# EAGLE design 24V_LM7824 (EAGLE 9.5.1)
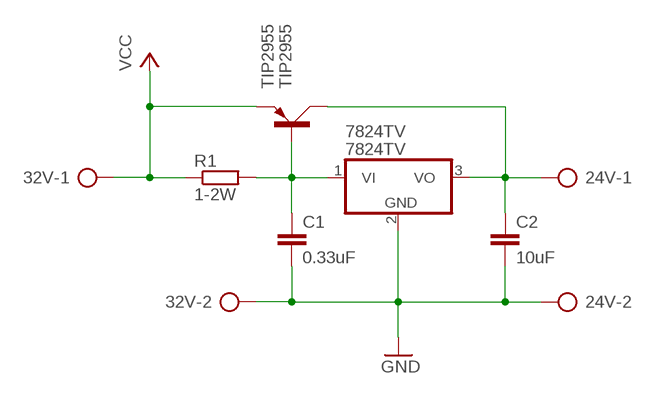
[diagram p0: schematic, sheet 1]

## Parts
24V  SMKDSP_1,5/2  [SMKDSP_1,5/2]
32V  SMKDSP_1,5/2  [SMKDSP_1,5/2]
7824TV  7824TV  [TO220V]
C1  0.33uF  C-EU025-025X050  [C025-025X050]
C2  10uF  C-EU025-025X050  [C025-025X050]
R1  1-2W  R-EU_0309/10  [0309/10]
TIP2955  TIP2955  [TOP3AV]

## Nets
GND: 24V.2 32V.2 7824TV.2(GND) C1.2 C2.2
N$1: 7824TV.1(VI) C1.1 R1.2 TIP2955.B
N$2: 24V.1 7824TV.3(VO) C2.1 TIP2955.C
VCC: 32V.1 R1.1 TIP2955.E

## Library data of the parts
24V 32V = con-phoenix-smkdsp:SMKDSP_1,5/2: Printklemme, Nennstrom: 17,5 A, Bemessungsspannung: 250 V, Raster: 5,0 mm Source: http://eshop.phoenixcontact.de .. 1733415.pdf; MF: FARNELL; MPN: 1733570; OC_FARNELL: 3041244; OC_NEWARK: 69C8588
7824TV = linear:78*: Positive VOLTAGE REGULATOR Source: http://cache.national.com/ds/LM/LM78L05.pdf http://www.fairchildsemi.com/ds/LM/LM7805.pdf
C1 C2 = rcl:C-EU: CAPACITOR, European symbol; SPICEPREFIX: C
R1 = rcl:R-EU_: RESISTOR, European symbol; SPICEPREFIX: R
TIP2955 = transistor-power:TIP2955: PNP TRANSISTOR

## Board
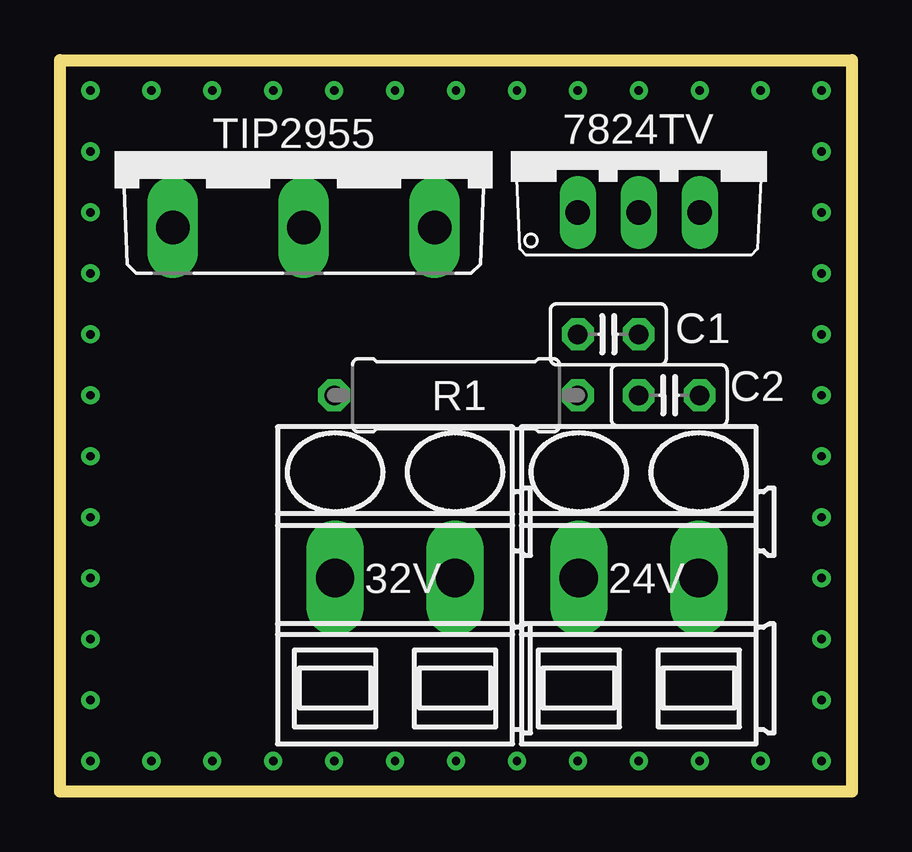
[diagram p1: board, top side]
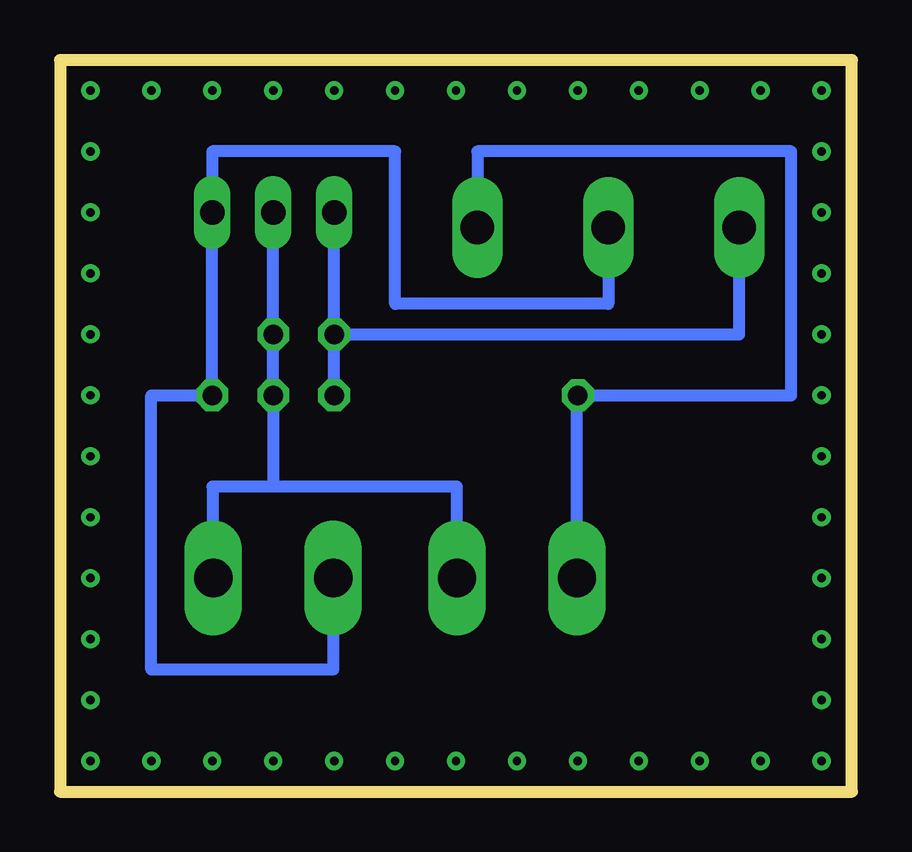
[diagram p2: board, bottom side, seen from below]

Size 33.02 x 30.48 mm. Coordinates in mm from the lower left corner, seen from the top.
Outline: 0,30.48 33.02,30.48 33.02,0 0,0 0,30.48
Copper layers (1*16): Top 0.035mm / dielectric 1.5mm / Bottom 0.035mm
Design rules "default": minimum track width 6mil, minimum drill 0.35mm, track to track 6mil, track to pad 6mil, pad to pad 6mil, via to via 6mil, smd to smd 6mil, copper to edge 40mil, drill to drill 6mil, minimum pad ring 10mil, minimum via ring 8mil, stop-mask expansion 4mil, vias tented up to drill 0mil, thermal gap 10mil

### Footprints (pad centres in the part's own frame; a part is rotated, then mirrored left to right if it is on the bottom)
SMKDSP_1,5/2 = drill 1.6 pad 1.8 long: 1 -2.5,0; 2 2.5,0
TO220V = drill 1.016 long: 1 -2.54,-2.54; 2 0,-2.54; 3 2.54,-2.54
C025-025X050 = drill 0.813 octagon: 1 -1.27,0; 2 1.27,0
0309/10 = drill 0.813 octagon: 1 -5.08,0; 2 5.08,0
TOP3AV = drill 1.397 long: B -5.461,-3.175; C 0,-3.175; E 5.461,-3.175

### Placement (x,y rotation side)
24V  24.13,8.89 0 top
32V  13.97,8.89 0 top
7824TV  24.13,26.67 0 top
C1  22.86,19.05 0 top
C2  25.4,16.51 180 top
R1  16.51,16.51 0 top
TIP2955  10.16,26.67 0 top

### Tracks (layer width: path | path; a pad name or v marks a point on that pad's centre or on a via)
GND
  Bottom 0.508: 24V.2 26.63,12.7 | 26.63,12.7 26.67,12.7 | 32V.2 16.47,12.7 24.13,12.7 | 24.13,12.7 26.63,12.7 | 7824TV.2 C1.2 C2.2 24.13,12.7
N$1
  Bottom 0.508: R1.2 C1.1 | C1.1 7824TV.1 | TIP2955.B 4.7,19.05 C1.1
N$2
  Bottom 0.508: 24V.1 21.63,5.08 29.21,5.08 29.21,16.51 C2.1 7824TV.3 26.67,26.67 19.05,26.67 19.05,20.32 10.16,20.32 TIP2955.C
N$3  (via drill 0.35)
  other vias: 26.67,1.27
N$4  (via drill 0.35)
  other vias: 29.21,1.27
N$5  (via drill 0.35)
  other vias: 31.75,1.27
N$6  (via drill 0.35)
  other vias: 31.75,3.81
N$7  (via drill 0.35)
  other vias: 31.75,6.35
N$8  (via drill 0.35)
  other vias: 31.75,8.89
N$9  (via drill 0.35)
  other vias: 31.75,11.43
N$10  (via drill 0.35)
  other vias: 31.75,13.97
N$11  (via drill 0.35)
  other vias: 31.75,16.51
N$12  (via drill 0.35)
  other vias: 31.75,19.05
N$13  (via drill 0.35)
  other vias: 31.75,21.59
N$14  (via drill 0.35)
  other vias: 31.75,24.13
N$15  (via drill 0.35)
  other vias: 31.75,26.67
N$16  (via drill 0.35)
  other vias: 31.75,29.21
N$17  (via drill 0.35)
  other vias: 29.21,29.21
N$18  (via drill 0.35)
  other vias: 26.67,29.21
N$19  (via drill 0.35)
  other vias: 24.13,29.21
N$20  (via drill 0.35)
  other vias: 21.59,29.21
N$21  (via drill 0.35)
  other vias: 19.05,29.21
N$22  (via drill 0.35)
  other vias: 16.51,29.21
N$23  (via drill 0.35)
  other vias: 13.97,29.21
N$24  (via drill 0.35)
  other vias: 11.43,29.21
N$25  (via drill 0.35)
  other vias: 8.89,29.21
N$26  (via drill 0.35)
  other vias: 6.35,29.21
N$27  (via drill 0.35)
  other vias: 3.81,29.21
N$28  (via drill 0.35)
  other vias: 1.27,29.21
N$29  (via drill 0.35)
  other vias: 1.27,26.67
N$30  (via drill 0.35)
  other vias: 1.27,24.13
N$31  (via drill 0.35)
  other vias: 1.27,21.59
N$32  (via drill 0.35)
  other vias: 1.27,19.05
N$33  (via drill 0.35)
  other vias: 1.27,16.51
N$34  (via drill 0.35)
  other vias: 1.27,13.97
N$35  (via drill 0.35)
  other vias: 1.27,11.43
N$36  (via drill 0.35)
  other vias: 1.27,8.89
N$37  (via drill 0.35)
  other vias: 1.27,6.35
N$38  (via drill 0.35)
  other vias: 1.27,3.81
N$39  (via drill 0.35)
  other vias: 1.27,1.27
N$40  (via drill 0.35)
  other vias: 3.81,1.27
N$41  (via drill 0.35)
  other vias: 6.35,1.27
N$42  (via drill 0.35)
  other vias: 8.89,1.27
N$43  (via drill 0.35)
  other vias: 11.43,1.27
N$44  (via drill 0.35)
  other vias: 13.97,1.27
N$45  (via drill 0.35)
  other vias: 16.51,1.27
N$46  (via drill 0.35)
  other vias: 19.05,1.27
N$47  (via drill 0.35)
  other vias: 21.59,1.27
N$48  (via drill 0.35)
  other vias: 24.13,1.27
VCC
  Bottom 0.508: 32V.1 11.47,16.51 R1.1 2.54,16.51 2.54,26.67 15.62,26.67 TIP2955.E